# EAGLE design 16X2LCD_SIMPLE_SPI (EAGLE 6.4)
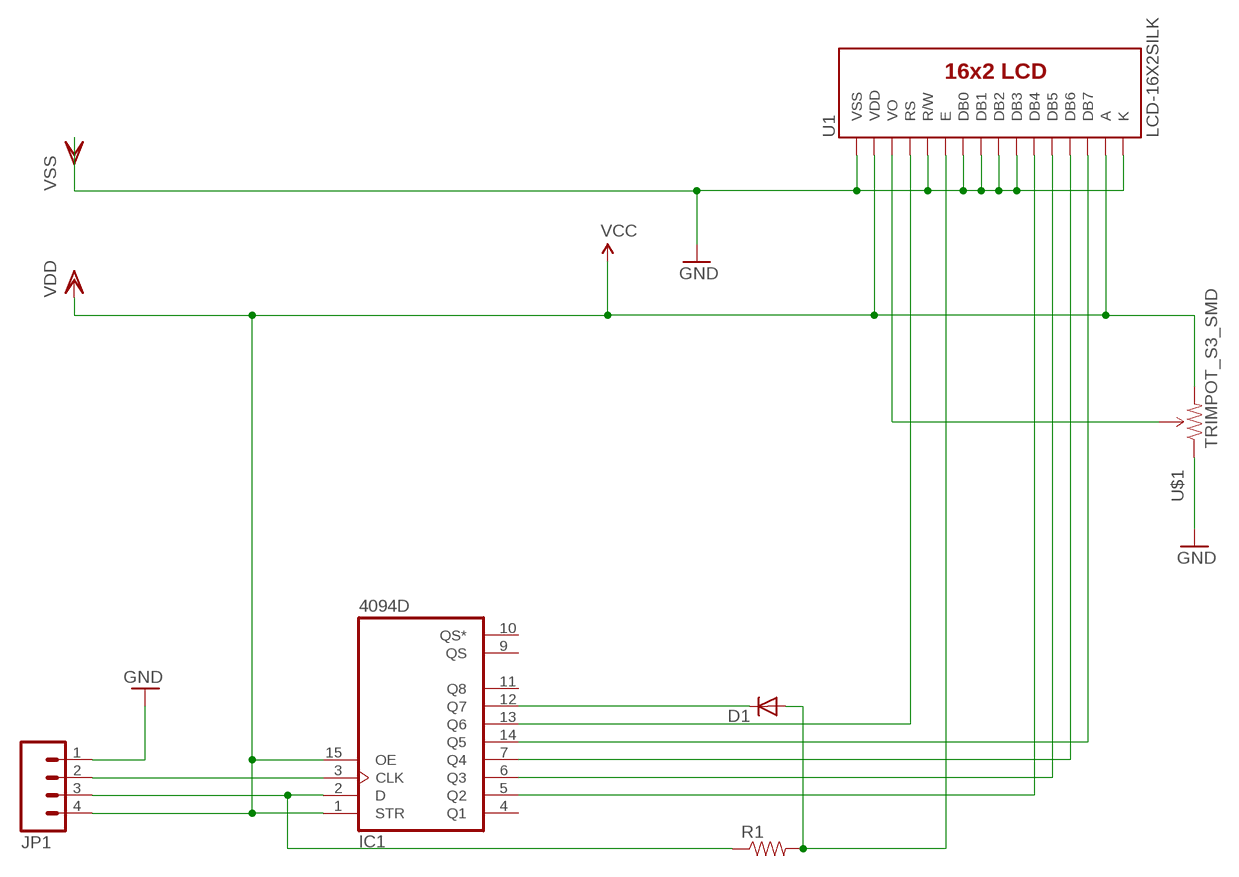
[diagram p0: schematic, sheet 1]

## Parts
D1  DIODESMA  [SMA-DIODE]
IC1  4094D  [SO16]
JP1  M04PTH  [1X04]
R1  RESISTOR1206  [1206]
U1  LCD-16X2SILK  [LCD-16X2]
U$1  TRIMPOT_S3_SMD  [TRIMPOT_S3_SMD]

## Nets
CLK: IC1.3(CLK) JP1.2
DATA: IC1.2(D) JP1.3 R1.1
GND: JP1.1 U1.1(VSS) U1.5(R/W) U1.7(DB0) U1.8(DB1) U1.9(DB2) U1.10(DB3) U1.16(K) U$1.P$1(CCW) ; supply symbol labelled VSS
N$1: IC1.13(Q6) U1.4(RS)
N$2: D1.A R1.2 U1.6(E)
N$3: U1.3(VO) U$1.P$2(WIPER)
N$4: D1.C IC1.12(Q7)
N$6: IC1.5(Q2) U1.11(DB4)
N$7: IC1.6(Q3) U1.12(DB5)
N$9: IC1.7(Q4) U1.13(DB6)
N$10: IC1.14(Q5) U1.14(DB7)
VDD: IC1.1(STR) IC1.15(OE) JP1.4 U1.2(VDD) U1.15(A) U$1.P$3(CW) ; supply symbol labelled VCC
Unconnected: IC1.4(Q1) IC1.9(QS) IC1.10(QS*) IC1.11(Q8)

## Power pins joined to a net without a drawn wire
GND: IC1.8(VSS)
VDD: IC1.16(VDD)

## Library data of the parts
D1 = SparkFun-DiscreteSemi:DIODE: Diode These are standard reverse protection diodes and small signal diodes. SMA package can handle up to about 1A. SOD-323 can handle about 200mA. What the SOD-323 package when ordering, there are some mfgs out there that are 5-pin packages.
IC1 = 40xx:4094: 8-stage SHIFT/STORE REGISTER, tri-state
JP1 = SparkFun:M04: Header 4 Standard 4-pin 0.1" header. Use with straight break away headers (SKU : PRT-00116), right angle break away headers (PRT-00553), swiss pins (PRT-00743), machine pins (PRT-00117), and female headers (PRT-00115). Molex polarized connector foot print use with SKU : PRT-08231 with associated crimp pins and housings. 1MM SMD Version SKU: PRT-10208
R1 = SparkFun-Passives:RESISTOR: Resistor Basic schematic elements and footprints for 0603, 1206, and PTH resistors.
U1 = SparkFun:LCD-16X2
U$1 = custom:TRIMPOT_S3_SMD

## Board
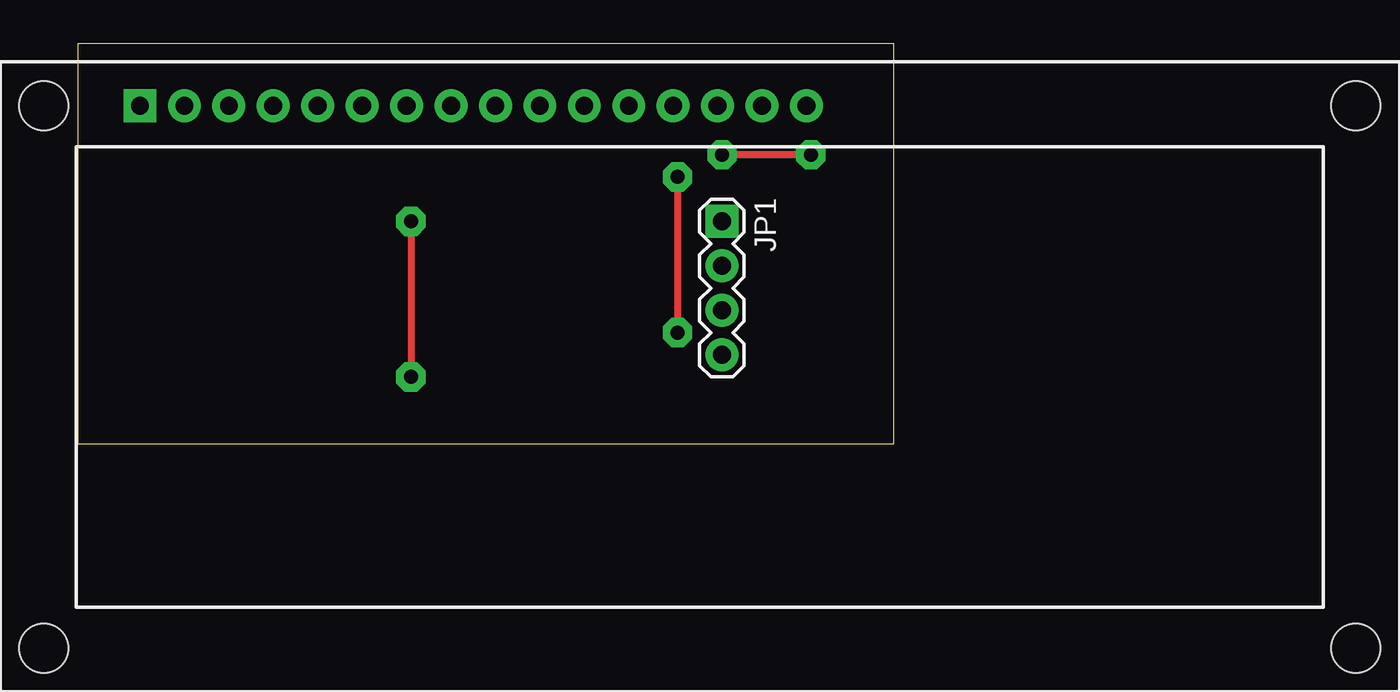
[diagram p1: board, top side]
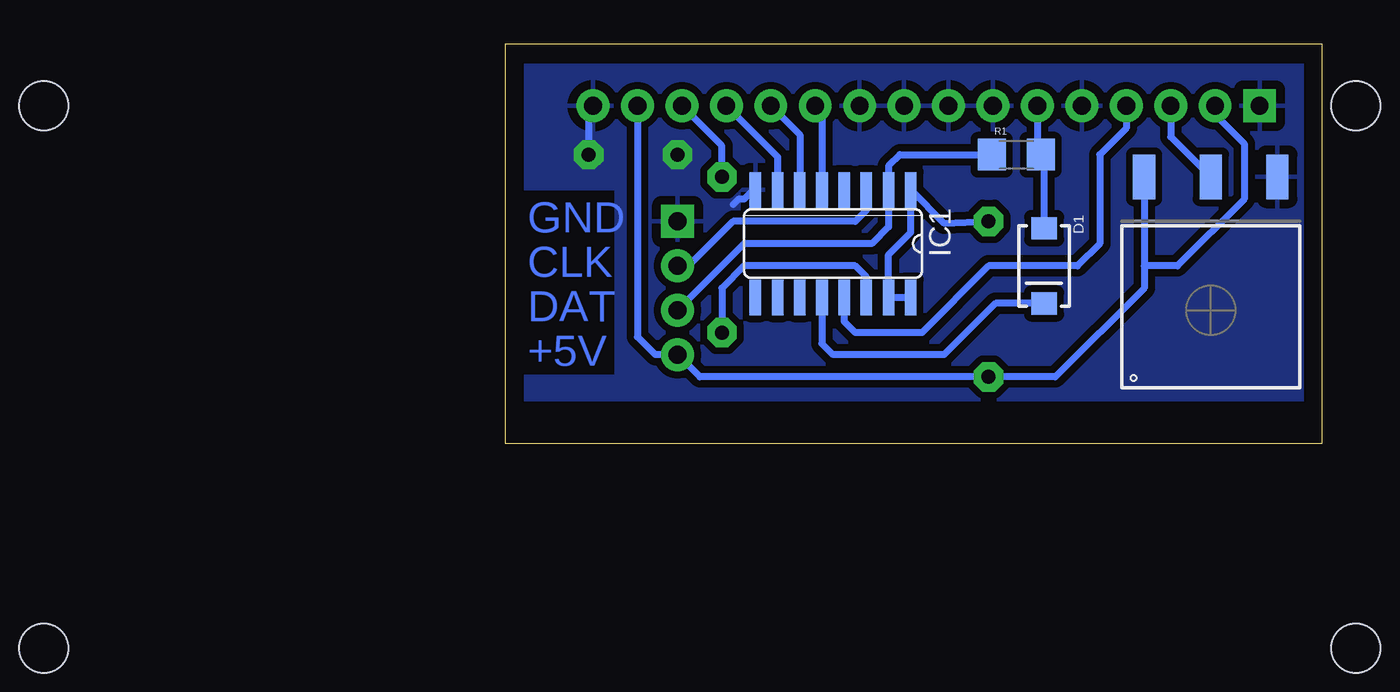
[diagram p2: board, bottom side, seen from below]

Size 46.67 x 22.86 mm. Coordinates in mm from the lower left corner, seen from the top.
Outline: 0,0.01 46.67,0 46.66,22.86 0,22.86 0,0.01
Copper layers (1*16): Top 0.035mm / dielectric 1.5mm / Bottom 0.035mm
Design rules "default *": minimum track width 10mil, minimum drill 24mil, track to track 8mil, track to pad 8mil, pad to pad 8mil, via to via 8mil, smd to smd 8mil, copper to edge 40mil, drill to drill 8mil, minimum pad ring 10mil, minimum via ring 8mil, stop-mask expansion 4mil, vias tented up to drill 0mil, thermal gap 20mil

### Footprints (pad centres in the part's own frame; a part is rotated, then mirrored left to right if it is on the bottom)
SMA-DIODE = smd 1.27 x 1.47: A -2.15,0; C 2.15,0
SO16 = smd 0.66 x 2.032: 1 -4.445,-3.073; 2 -3.175,-3.073; 3 -1.905,-3.073; 4 -0.635,-3.073; 5 0.635,-3.073; 6 1.905,-3.073; 7 3.175,-3.073; 8 4.445,-3.073; 9 4.445,3.073; 10 3.175,3.073; 11 1.905,3.073; 12 0.635,3.073; 13 -0.635,3.073; 14 -1.905,3.073; 15 -3.175,3.073; 16 -4.445,3.073
1X04 = drill 1.016 pad 1.88 square: 1 0,0 | drill 1.016 pad 1.88: 2 2.54,0; 3 5.08,0; 4 7.62,0
1206 = smd 1.6 x 1.8: 1 -1.4,0; 2 1.4,0
LCD-16X2 = drill 1.016 pad 1.88 square: 1 -32,15.5 | drill 1.016 pad 1.88: 2 -29.46,15.5; 3 -26.92,15.5; 4 -24.38,15.5; 5 -21.84,15.5; 6 -19.3,15.5; 7 -16.76,15.5; 8 -14.22,15.5; 9 -11.68,15.5; 10 -9.14,15.5; 11 -6.6,15.5; 12 -4.06,15.5; 13 -1.52,15.5; 14 1.02,15.5; 15 3.56,15.5; 16 6.1,15.5 | hole 2.8: -37.5,15.5; -37.5,-15.5; 37.5,15.5; 37.5,-15.5
TRIMPOT_S3_SMD = smd 1.27 x 2.54: P$1 -3.81,-6.35; P$2 0,-6.35; P$3 3.81,-6.35

### Placement (x,y rotation side)
D1  15.88,10.17 270 bottom
IC1  27.94,11.44 180 bottom
JP1  36.83,12.71 270 top
R1  17.46,16.52 0 bottom
U1  35.56,3.82 0 top
U$1  6.35,8.9 180 bottom

### Tracks (layer width: path | path; a pad name or v marks a point on that pad's centre or on a via)
CLK
  Bottom 0.406: IC1.3 26.04,13.35 26.67,12.71 33.66,12.71 36.2,10.17 JP1.2
DATA
  Bottom 0.406: JP1.3 33.02,11.44 25.72,11.44 24.77,12.39 IC1.2 24.77,15.89 24.13,16.52 R1.1
GND  (via drill 0.8 pad 1.68)
  Top 0.406: v41.91,16.52 v36.83,16.52
  Bottom 0.406: U1.16 41.91,19.07 v41.91,16.52 | IC1.8 32.49,14.52 33.02,13.98 33.34,13.98 33.66,13.66
  pour Bottom (isolate 0.406, rank 2, hatched): 0,2.55 0,21.6 45.72,21.6 45.72,14.62 40.32,14.62 40.32,3.82 45.72,3.82 45.72,2.55
N$1
  Bottom 0.406: IC1.13 27.3,7 26.67,6.36 22.86,6.36 19.05,10.17 13.97,10.17 12.7,11.44 12.7,16.52 11.18,18.04 U1.4
N$2
  Bottom 0.406: U1.6 16.26,16.52 R1.2 arc90 15.88,16.34 D1.A
N$3
  Bottom 0.406: U1.3 8.64,17.54 U$1.P$2
N$4
  Bottom 0.406: IC1.12 28.58,5.73 27.94,5.09 21.59,5.09 18.66,8.02 D1.C
N$6
  Bottom 0.406: U1.11 28.58,18.94 IC1.5
N$7
  Bottom 0.406: U1.12 29.84,17.67 IC1.6
N$9
  Bottom 0.406: U1.13 31.12,16.4 IC1.7
N$10  (via drill 0.8 pad 1.68)
  Top 0.406: v34.29,15.25 v34.29,6.36
  Bottom 0.406: IC1.14 26.04,9.54 26.67,10.17 33.02,10.17 34.29,8.9 v34.29,6.36 | v34.29,15.25 34.29,17.03 U1.14
VDD  (via drill 0.8 pad 1.68)
  Top 0.406: v19.05,12.71 v19.05,3.82
  Bottom 0.406: IC1.15 IC1.16 | IC1.15 24.77,10.81 23.49,12.08 IC1.1 21.59,12.61 v19.05,12.71 | U1.15 39.12,6.11 38.1,5.09 JP1.4 35.56,3.82 19.68,3.82 v19.05,3.82 15.24,3.82 10.16,8.9 10.16,10.17 | IC1.15 23.39,8.37 | U1.2 6.1,18.81 4.45,17.16 4.45,13.98 8.25,10.17 10.16,10.17 | U$1.P$3 10.16,10.17

### Text on the board
Bottom: GND | CLK | DAT | +5V